# Altium project Intelligent Tidal Energy Monitoring System.PrjPcb
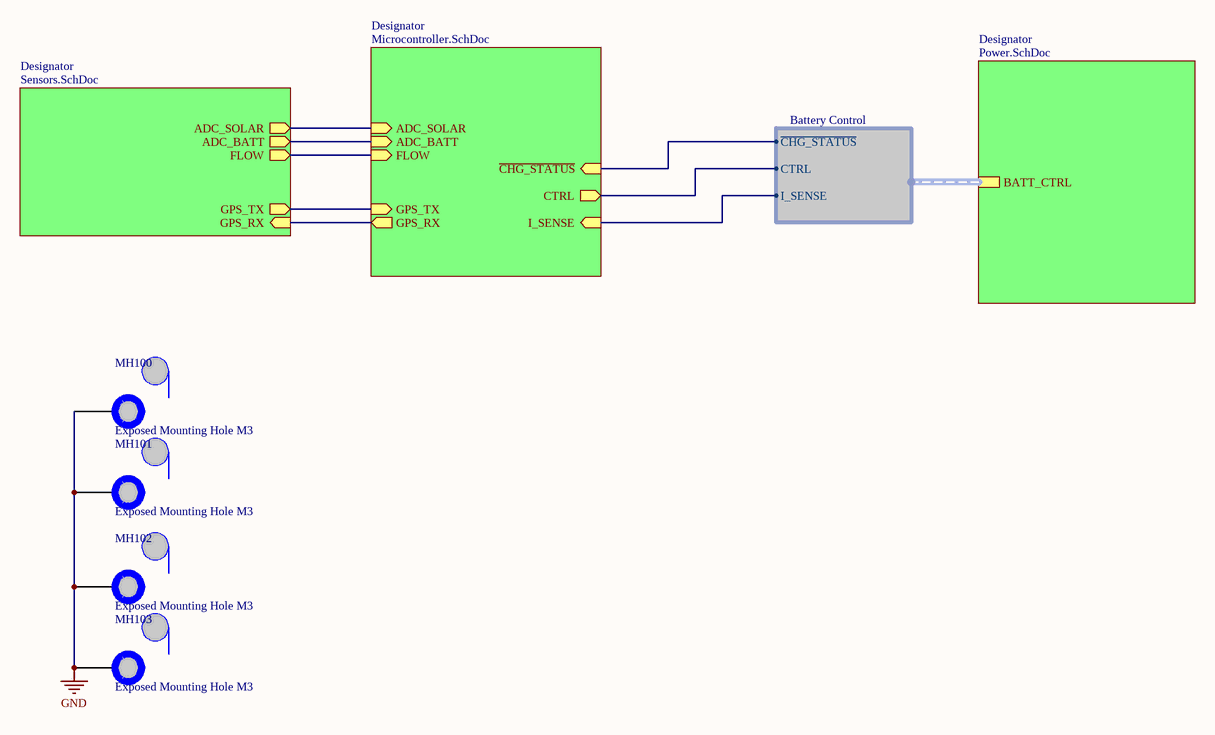
[diagram p0: Master.SchDoc]
5 sheets, 79 parts. Net scope: hierarchical (ports join the sheet entries above them; power ports are global).
Board file: ITEMS PCB Rev A.PcbDoc
Sheets:
  Master.SchDoc
    Designator = Microcontroller.SchDoc
    Designator = Sensors.SchDoc
    Designator = Power.SchDoc
  Block Diagram.SchDoc

## Sheet Master.SchDoc
size A4; SheetNumber: 1; SheetTotal: 5

### Parts
MH100  Exposed Mounting Hole M3  [Mounting Hole M3-Footprint-1]
MH101  Exposed Mounting Hole M3  [Mounting Hole M3-Footprint-1]
MH102  Exposed Mounting Hole M3  [Mounting Hole M3-Footprint-1]
MH103  Exposed Mounting Hole M3  [Mounting Hole M3-Footprint-1]

### Sub-sheets
Designator = Microcontroller.SchDoc: ADC_SOLAR (in), FLOW (in), ADC_BATT (in), GPS_RX (out), GPS_TX (in), CTRL (out), ~{CHG_STATUS} (in), I_SENSE (in)
Designator = Sensors.SchDoc: GPS_TX (out), FLOW (out), ADC_SOLAR (out), GPS_RX (in), ADC_BATT (out)
Designator = Power.SchDoc: BATT_CTRL (harness Battery Control)

### Harnesses
Battery Control: ~{CHG_STATUS}, CTRL, I_SENSE

### Nets
GND: MH100.0 MH101.0 MH102.0 MH103.0
~{CHG}: sheet Designator/~{CHG_STATUS}, sheet Designator/BATT_CTRL.~{CHG_STATUS}
CTRL: sheet Designator/CTRL, sheet Designator/BATT_CTRL.CTRL
I_SENSE: sheet Designator/I_SENSE, sheet Designator/BATT_CTRL.I_SENSE
NetIC400_3: sheet Designator/ADC_BATT, sheet Designator/ADC_BATT
NetIC401_3: sheet Designator/ADC_SOLAR, sheet Designator/ADC_SOLAR
NetJ400_3: sheet Designator/FLOW, sheet Designator/FLOW
NetJ401_2: sheet Designator/GPS_RX, sheet Designator/GPS_RX
NetJ401_3: sheet Designator/GPS_TX, sheet Designator/GPS_TX

### Library data of the parts
MH100-MH103 = CMP-00028-00002-1: M3 Mounting Hole Exposed

## Sheet Microcontroller.SchDoc
size A4; SheetNumber: 2; SheetTotal: 5
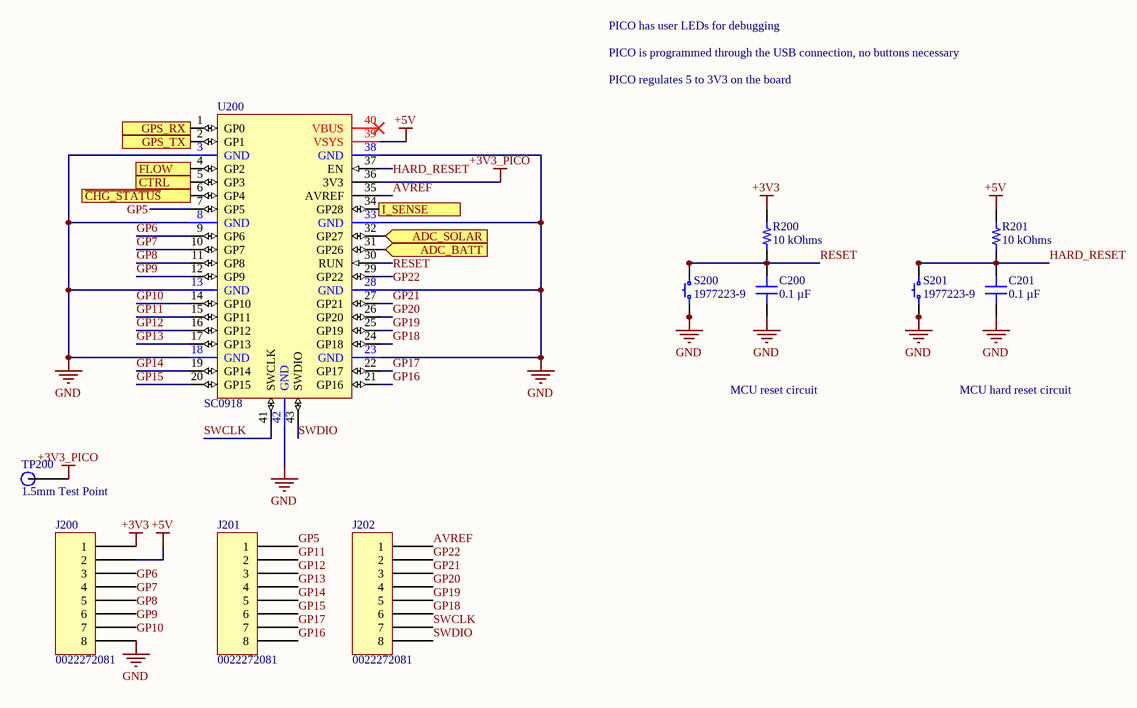
[diagram p1: Microcontroller.SchDoc]

### Parts
C200  0.1 µF  [CAP 0603_1608]
C201  0.1 µF  [CAP 0603_1608]
J200  0022272081  [MOLEX KK 0022272081]
J201  0022272081  [MOLEX KK 0022272081]
J202  0022272081  [MOLEX KK 0022272081]
R200  10 kOhms  [RES 0603_1608]
R201  10 kOhms  [RES 0603_1608]
S200  1977223-9  [TE FSM4JSMA]
S201  1977223-9  [TE FSM4JSMA]
TP200  1.5mm Test Point  [1mm Test Point-Footprint-1]
U200  SC0918  [New footprint 1]

### Ports
ADC_BATT (in), ADC_SOLAR (in), CTRL (out), FLOW (in), GPS_RX (out), GPS_TX (in), I_SENSE (in), ~{CHG_STATUS} (in)

### Nets
+3V3: J200.1 R200.2
+3V3_PICO: TP200.1 U200.36(3V3)
+5V: J200.2 R201.2 U200.39(VSYS)
GND: C200.1 C201.1 J200.8 S200.1 S200.2 S201.1 S201.2 U200.3(GND) U200.8(GND) U200.13(GND) U200.18(GND) U200.23(GND) U200.28(GND) U200.33(GND) U200.38(GND) U200.42(GND)
AVREF: J202.1 U200.35(AVREF)
~{CHG}: U200.6(GP4) ; port ~{CHG_STATUS}
CTRL: U200.5(GP3) ; port CTRL
GP5: J201.1 U200.7(GP5)
GP6: J200.3 U200.9(GP6)
GP7: J200.4 U200.10(GP7)
GP8: J200.5 U200.11(GP8)
GP9: J200.6 U200.12(GP9)
GP10: J200.7 U200.14(GP10)
GP11: J201.2 U200.15(GP11)
GP12: J201.3 U200.16(GP12)
GP13: J201.4 U200.17(GP13)
GP14: J201.5 U200.19(GP14)
GP15: J201.6 U200.20(GP15)
GP16: J201.8 U200.21(GP16)
GP17: J201.7 U200.22(GP17)
GP18: J202.6 U200.24(GP18)
GP19: J202.5 U200.25(GP19)
GP20: J202.4 U200.26(GP20)
GP21: J202.3 U200.27(GP21)
GP22: J202.2 U200.29(GP22)
HARD_RESET: C201.2 R201.1 S201.3 S201.4 U200.37(EN)
I_SENSE: U200.34(GP28) ; port I_SENSE
RESET: C200.2 R200.1 S200.3 S200.4 U200.30(RUN)
SWCLK: J202.7 U200.41(SWCLK)
SWDIO: J202.8 U200.43(SWDIO)
NetIC400_3: U200.31(GP26) ; port ADC_BATT
NetIC401_3: U200.32(GP27) ; port ADC_SOLAR
NetJ400_3: U200.4(GP2) ; port FLOW
NetJ401_2: U200.1(GP0) ; port GPS_RX
NetJ401_3: U200.2(GP1) ; port GPS_TX

Not connected (* = marked no-connect by the designer): U200 40(VBUS)*

### Notes on the sheet
- PICO has user LEDs for debugging
- PICO is programmed through the USB connection, no buttons necessary
- PICO regulates 5 to 3V3 on the board
- MCU reset circuit
- MCU hard reset circuit

### Library data of the parts
C200 C201 = C0603X104M3RAC7867: CAP CER 0.1UF 25V X7R 0603; manufacturer: KEMET; Tolerance: ±20%; Part Number: C0603X104M3RAC7867; Value: 0.1 µF; Applications: Boardflex Sensitive; Capacitance: 0.1 µF; componentlink1description: Datasheet; componentlink1url: https://api.kemet.com/component-edge/download/datasheet/C0603X104M3RACTU.pdf; componentlink2description: DigiKey Link; componentlink2url: https://www.digikey.com/en/products/detail/kemet/C0603X104M3RAC7867/2202613; Device Package: 0603 (1608 Metric); Features: Soft Termination; lastupdated: 2022-03-07 3:18:24 PM; Lifecycle Status: Active; Minimum Order: 1; Mounting Type: Surface Mount, MLCC; Operating Temperature: -55°C ~ 125°C; Package / Case: 0603 (1608 Metric); packaging: TapeAndReel; partid: 2484; Part Status: Active; price: 0.07; series: SMD Comm X7R Flex; Size / Dimension: 0.063" L x 0.031" W (1.60mm x 0.80mm); Supplier 1: DigiKey; Supplier Part Number 1: 399-13148-1-ND; Temperature Coefficient: X7R; Thickness (Max): 0.034" (0.87mm); Voltage - Rated: 25V
J200-J202 = 0022272081: CONN HEADER VERT 8POS 2.54MM; Manufacturer: Molex; Contact Length - Mating: 0.295" (7.49mm); Contact Length - Post: 0.140" (3.56mm); Material Flammability Rating: UL94 V-0; Number of Positions: 8; Number of Positions Loaded: All; Overall Contact Length: 0.560" (14.22mm); Pitch - Mating: 0.100" (2.54mm); Shrouding: Shrouded - 1 Wall; Style: Board to Cable/Wire; Part Number: 0022272081; ComponentLink1Description: Datasheet; ComponentLink1URL: https://www.molex.com/pdm_docs/sd/022272081_sd.pdf; ComponentLink2Description: DigiKey Link; ComponentLink2URL: http://digikey.com/product-detail/en/molex/0022272081/WM4117-ND/1130583; Connector Type: Header; Contact Finish - Mating: Tin; Contact Finish - Post: Tin; Contact Finish Thickness - Mating: 100.0µin (2.54µm); Contact Material: Brass; Contact Shape: Square; Contact Type: Male Pin; Fastening Type: Friction Lock; Insulation Color: Natural; Insulation Height: 0.461" (11.70mm); Insulation Material: Polyamide (PA), Nylon; LastUpdated: 2020-01-12 11:52:41 PM; Lifecycle Status: Active; Minimum Order: 1; Mounting Type: Through Hole; Number of Rows: 1; Packaging: Bulk; PartId: 82; Part Status: Active; Price: 0.60; Series: KK 6410; Supplier 1: DigiKey; Supplier Part Number 1: WM4117-ND; Termination: Solder
R200 R201 = RT0603FRE0710KL: RES SMD 10K OHM 1% 1/10W 0603; Manufacturer: Yageo; Power (Watts): 0.1W, 1/10W; Temperature Coefficient: ±50ppm/°C; Part Number: RT0603FRE0710KL; Value: 10 kOhms; ComponentLink1Description: Datasheet; ComponentLink1URL: https://www.yageo.com/upload/media/product/productsearch/datasheet/rchip/PYu-RT_1-to-0.01_RoHS_L_11.pdf; ComponentLink2Description: DigiKey Link; ComponentLink2URL: http://digikey.com/product-detail/en/yageo/RT0603FRE0710KL/YAG2321CT-ND/5252435; Composition: Thin Film; Device Package: 0603 (1608 Metric); Height - Seated (Max): 0.022" (0.55mm); LastUpdated: 2022-03-07 3:35:56 PM; Lifecycle Status: Active; Minimum Order: 1; Number of Terminations: 2; Operating Temperature: -55°C ~ 155°C; Package / Case: 0603 (1608 Metric); Packaging: TapeAndReel; PartId: 5671; Part Status: Active; Price: 0.01; Resistance: 10 kOhms; Series: RT; Size / Dimension: 0.063" L x 0.031" W (1.60mm x 0.80mm); Supplier 1: DigiKey; Supplier Part Number 1: YAG2321CT-ND; Supplier Device Package: 0603; Tolerance: ±1%
S200 S201 = 1977223-9: SWITCH TACTILE SPST-NO 0.05A 24V; Manufacturer: TE Connectivity ALCOSWITCH Switches; Actuator Height off PCB, Vertical: 5.00mm; Actuator Orientation: Top Actuated; Actuator Type: Standard; Contact Rating @ Voltage: 0.05A @ 24VDC; Illumination: Non-Illuminated; Operating Force: 160gf; Outline: 6.00mm x 6.00mm; Switch Function: Off-Mom; Part Number: 1977223-9; Circuit: SPST-NO; ComponentLink1Description: Datasheet; ComponentLink1URL: https://www.te.com/commerce/DocumentDelivery/DDEController?Action=srchrtrv&DocNm=1308111-1_SWITCHES_CORE_PROGRAM_CATALOG&DocType=CS&DocLang=English; ComponentLink2Description: DigiKey Link; ComponentLink2URL: http://digikey.com/product-detail/en/te-connectivity-alcoswitch-switches/1977223-9/1977223-9-ND/5597033; LastUpdated: 2020-08-30 9:06:45 PM; Lifecycle Status: Active; Minimum Order: 30000; Mounting Type: Surface Mount; Packaging: Bulk; Price: 0.16; Series: FSMJSMA; Supplier 1: DigiKey; Supplier Part Number 1: 1977223-9-ND; Termination Style: Gull Wing
TP200 = CMP-002-00006-1: 1.5mm Test Point 0.75mm hole size
U200 = CMP-00055-1: Raspberry Pi Pico W

## Sheet Sensors.SchDoc
size A4; SheetNumber: 4; SheetTotal: 5
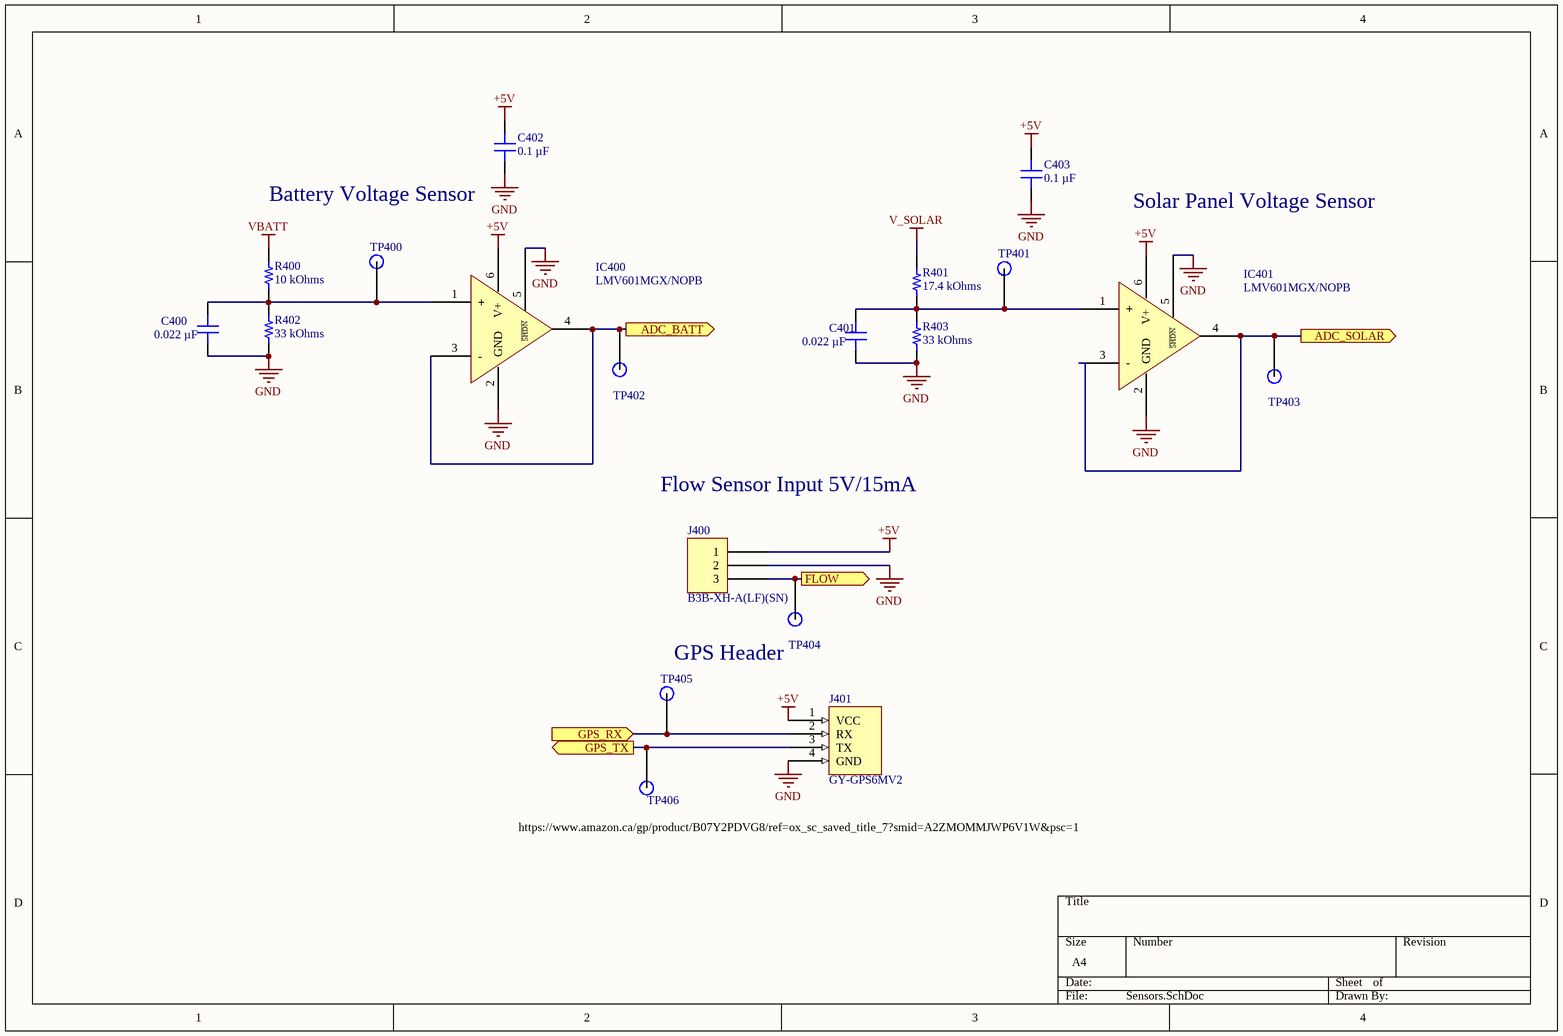
[diagram p2: Sensors.SchDoc]

### Parts
C400  0.022 µF  [CAP 0603_1608]
C401  0.022 µF  [CAP 0603_1608]
C402  0.1 µF  [CAP 0603_1608]
C403  0.1 µF  [CAP 0603_1608]
IC400  LMV601MGX/NOPB  [TI SC70-6 DCK]
IC401  LMV601MGX/NOPB  [TI SC70-6 DCK]
J400  B3B-XH-A(LF)(SN)  [JST XH B3B-XH-A]
J401  GY-GPS6MV2  [GY-GPS6MV2 -Footprint-1]
R400  10 kOhms  [RES 0603_1608]
R401  17.4 kOhms  [RES 0603_1608]
R402  33 kOhms  [RES 0603_1608]
R403  33 kOhms  [RES 0603_1608]
TP400  1.5mm Test Point  [1mm Test Point-Footprint-1]  (value not drawn)
TP401  1.5mm Test Point  [1mm Test Point-Footprint-1]  (value not drawn)
TP402  1.5mm Test Point  [1mm Test Point-Footprint-1]  (value not drawn)
TP403  1.5mm Test Point  [1mm Test Point-Footprint-1]  (value not drawn)
TP404  1.5mm Test Point  [1mm Test Point-Footprint-1]  (value not drawn)
TP405  1.5mm Test Point  [1mm Test Point-Footprint-1]  (value not drawn)
TP406  1.5mm Test Point  [1mm Test Point-Footprint-1]  (value not drawn)

### Ports
ADC_BATT (out), ADC_SOLAR (out), FLOW (out), GPS_RX (in), GPS_TX (out)

### Nets
+5V: C402.2 C403.2 IC400.6(V+) IC401.6(V+) J400.1 J401.1(VCC)
GND: C400.1 C401.1 C402.1 C403.1 IC400.2(GND) IC400.5(~{SHDN}) IC401.2(GND) IC401.5(~{SHDN}) J400.2 J401.4(GND) R402.1 R403.1
V_SOLAR: R401.2
VBATT: R400.2
NetC400_2: C400.2 IC400.1(+) R400.1 R402.2 TP400.1
NetC401_2: C401.2 IC401.1(+) R401.1 R403.2 TP401.1
NetIC400_3: IC400.3(-) IC400.4(OUT) TP402.1 ; port ADC_BATT
NetIC401_3: IC401.3(-) IC401.4(OUT) TP403.1 ; port ADC_SOLAR
NetJ400_3: J400.3 TP404.1 ; port FLOW
NetJ401_2: J401.2(RX) TP405.1 ; port GPS_RX
NetJ401_3: J401.3(TX) TP406.1 ; port GPS_TX

### Notes on the sheet
- (near C402) Battery Voltage Sensor
- Solar Panel Voltage Sensor
- Flow Sensor Input 5V/15mA
- GPS Header
- (near TP406) https://www.amazon.ca/gp/product/B07Y2PDVG8/ref=ox_sc_saved_title_7?smid=A2ZMOMMJWP6V1W&psc=1

### Library data of the parts
C400 C401 = CC0603KRX7R7BB223: CAP CER 0.022UF 16V X7R 0603; manufacturer: Yageo; Tolerance: ±10%; Part Number: CC0603KRX7R7BB223; Value: 0.022 µF; Applications: General Purpose; Capacitance: 0.022 µF; componentlink1description: Datasheet; componentlink1url: https://www.yageo.com/upload/media/product/productsearch/datasheet/mlcc/UPY-GPHC_X7R_6.3V-to-50V_18.pdf; componentlink2description: DigiKey Link; componentlink2url: https://www.digikey.com/en/products/detail/yageo/CC0603KRX7R7BB223/5195208; Device Package: 0603 (1608 Metric); lastupdated: 2022-09-19 1:01:04 PM; Lifecycle Status: Active; Minimum Order: 1; Mounting Type: Surface Mount, MLCC; Operating Temperature: -55°C ~ 125°C; Package / Case: 0603 (1608 Metric); packaging: TapeAndReel; partid: 7845; Part Status: Active; price: 0.01; series: CC; Size / Dimension: 0.063" L x 0.031" W (1.60mm x 0.80mm); Supplier 1: DigiKey; Supplier Part Number 1: 311-1800-1-ND; Temperature Coefficient: X7R; Thickness (Max): 0.035" (0.90mm); Voltage - Rated: 16V
C402 C403 = C0603X104M3RAC7867: as C200 on sheet Microcontroller; Part Number: C0603X104M3RAC7867; Value: 0.1 µF; Applications: Boardflex Sensitive; Capacitance: 0.1 µF; componentlink1description: Datasheet; componentlink1url: https://api.kemet.com/component-edge/download/datasheet/C0603X104M3RACTU.pdf; componentlink2description: DigiKey Link; componentlink2url: https://www.digikey.com/en/products/detail/kemet/C0603X104M3RAC7867/2202613; Device Package: 0603 (1608 Metric); Features: Soft Termination; lastupdated: 2022-03-07 3:18:24 PM; Lifecycle Status: Active; Minimum Order: 1; Mounting Type: Surface Mount, MLCC; Operating Temperature: -55°C ~ 125°C; Package / Case: 0603 (1608 Metric); packaging: TapeAndReel; partid: 2484; Part Status: Active; price: 0.07; series: SMD Comm X7R Flex; Size / Dimension: 0.063" L x 0.031" W (1.60mm x 0.80mm); Supplier 1: DigiKey; Supplier Part Number 1: 399-13148-1-ND; Temperature Coefficient: X7R; Thickness (Max): 0.034" (0.87mm); Voltage - Rated: 25V
IC400 IC401 = LMV601MGX/NOPB: IC OPAMP GP 1 CIRCUIT SC70-6; Manufacturer: Texas Instruments; Amplifier Type: General Purpose; Current - Input Bias: 0.02pA; Current - Output / Channel: 113mA; Current - Supply: 107µA; Gain Bandwidth Product: 1MHz; Number of Circuits: 1; Output Type: Rail-to-Rail; Slew Rate: 1V/µs; Voltage - Input Offset: 250µV; Voltage - Supply, Single/Dual (±): 2.7V ~ 5.5V; Part Number: LMV601MGX/NOPB; ComponentLink1Description: Datasheet; ComponentLink1URL: http://www.ti.com/general/docs/suppproductinfo.tsp?distId=10&gotoUrl=http%3A%2F%2Fwww.ti.com%2Flit%2Fgpn%2Flmv601; ComponentLink2Description: DigiKey Link; ComponentLink2URL: http://digikey.com/product-detail/en/texas-instruments/LMV601MGX-NOPB/296-46438-1-ND/7033611; Device Package: 6-TSSOP, SC-88, SOT-363; LastUpdated: 2020-01-09 2:17:00 AM; Lifecycle Status: Active; Minimum Order: 1; Mounting Type: Surface Mount; Operating Temperature: -40°C ~ 125°C; Package / Case: 6-TSSOP, SC-88, SOT-363; Packaging: ReReel; PartId: 25; Part Status: Active; Price: 0.00; Series: -; Supplier 1: DigiKey; Supplier Part Number 1: 296-46438-1-ND; Supplier Device Package: SC-70-6
J400 = B3B-XH-A(LF)(SN): CONN HEADER VERT 3POS 2.5MM; Manufacturer: JST Sales America Inc.; Contact Length - Post: 0.134" (3.40mm); Current Rating (Amps): 3A; Material Flammability Rating: UL94 V-0; Number of Positions: 3; Number of Positions Loaded: All; Pitch - Mating: 0.098" (2.50mm); Shrouding: Shrouded - 4 Wall; Style: Board to Cable/Wire; Voltage Rating: 250V; Part Number: B3B-XH-A(LF)(SN); ComponentLink1Description: Datasheet; ComponentLink1URL: http://www.jst-mfg.com/product/pdf/eng/eXH.pdf; ComponentLink2Description: DigiKey Link; ComponentLink2URL: http://digikey.com/product-detail/en/jst-sales-america-inc/B3B-XH-A-LF-SN/455-2248-ND/1651046; Connector Type: Header; Contact Finish - Mating: Tin; Contact Finish - Post: Tin; Contact Material: Brass; Contact Shape: Square; Contact Type: Male Pin; Fastening Type: Detent Lock; Insulation Color: Natural; Insulation Height: 0.276" (7.00mm); Insulation Material: Polyamide (PA66), Nylon 6/6; LastUpdated: 2020-01-12 11:46:22 PM; Lifecycle Status: Active; Minimum Order: 1; Mounting Type: Through Hole; Number of Rows: 1; Operating Temperature: -25°C ~ 85°C; Packaging: Bulk; PartId: 68; Part Status: Active; Price: 0.19; Series: XH; Supplier 1: DigiKey; Supplier Part Number 1: 455-2248-ND; Termination: Press-Fit, Solder
J401 = CMP-00056-2: NEO-6M GPS Module
R400 = RT0603FRE0710KL: as R200 on sheet Microcontroller; Part Number: RT0603FRE0710KL; Value: 10 kOhms; ComponentLink1Description: Datasheet; ComponentLink1URL: https://www.yageo.com/upload/media/product/productsearch/datasheet/rchip/PYu-RT_1-to-0.01_RoHS_L_11.pdf; ComponentLink2Description: DigiKey Link; ComponentLink2URL: http://digikey.com/product-detail/en/yageo/RT0603FRE0710KL/YAG2321CT-ND/5252435; Composition: Thin Film; Device Package: 0603 (1608 Metric); Height - Seated (Max): 0.022" (0.55mm); LastUpdated: 2022-03-07 3:35:56 PM; Lifecycle Status: Active; Minimum Order: 1; Number of Terminations: 2; Operating Temperature: -55°C ~ 155°C; Package / Case: 0603 (1608 Metric); Packaging: TapeAndReel; PartId: 5671; Part Status: Active; Price: 0.01; Resistance: 10 kOhms; Series: RT; Size / Dimension: 0.063" L x 0.031" W (1.60mm x 0.80mm); Supplier 1: DigiKey; Supplier Part Number 1: YAG2321CT-ND; Supplier Device Package: 0603; Tolerance: ±1%
R401 = RC0603FR-0717K4L: RES 17.4K OHM 1% 1/10W 0603; Manufacturer: Yageo; Power (Watts): 0.1W, 1/10W; Temperature Coefficient: ±100ppm/°C; Part Number: RC0603FR-0717K4L; Value: 17.4 kOhms; ComponentLink1Description: Datasheet; ComponentLink1URL: https://www.yageo.com/upload/media/product/productsearch/datasheet/rchip/PYu-RC_Group_51_RoHS_L_10.pdf; ComponentLink2Description: DigiKey Link; ComponentLink2URL: https://www.digikey.com/en/products/detail/yageo/RC0603FR-0717K4L/726981; Composition: Thick Film; Device Package: 0603 (1608 Metric); Features: Moisture Resistant; Height - Seated (Max): 0.022" (0.55mm); LastUpdated: 2022-09-19 1:22:24 PM; Lifecycle Status: Active; Minimum Order: 1; Number of Terminations: 2; Operating Temperature: -55°C ~ 155°C; Package / Case: 0603 (1608 Metric); Packaging: CutTape; PartId: 7526; Part Status: Active; Price: 0.01; Resistance: 17.4 kOhms; Series: RC_L; Size / Dimension: 0.063" L x 0.031" W (1.60mm x 0.80mm); Supplier 1: DigiKey; Supplier Part Number 1: 311-17.4KHRCT-ND; Supplier Device Package: 0603; Tolerance: ±1%
R402 R403 = RT0603FRE0733KL: RES SMD 33K OHM 1% 1/10W 0603; Manufacturer: Yageo; Power (Watts): 0.1W, 1/10W; Temperature Coefficient: ±50ppm/°C; Part Number: RT0603FRE0733KL; Value: 33 kOhms; ComponentLink1Description: Datasheet; ComponentLink1URL: https://www.yageo.com/upload/media/product/productsearch/datasheet/rchip/PYu-RT_1-to-0.01_RoHS_L_11.pdf; ComponentLink2Description: DigiKey Link; ComponentLink2URL: https://www.digikey.com/en/products/detail/yageo/RT0603FRE0733KL/1075313; Composition: Thin Film; Device Package: 0603 (1608 Metric); Height - Seated (Max): 0.022" (0.55mm); LastUpdated: 2022-09-19 1:22:31 PM; Lifecycle Status: Active; Minimum Order: 1; Number of Terminations: 2; Operating Temperature: -55°C ~ 155°C; Package / Case: 0603 (1608 Metric); Packaging: TapeAndReel; PartId: 5680; Part Status: Active; Price: 0.01; Resistance: 33 kOhms; Series: RT; Size / Dimension: 0.063" L x 0.031" W (1.60mm x 0.80mm); Supplier 1: DigiKey; Supplier Part Number 1: YAG5959CT-ND; Supplier Device Package: 0603; Tolerance: ±1%
TP400-TP406 = CMP-002-00006-1: 1.5mm Test Point 0.75mm hole size

## Sheet Power.SchDoc
size A4; SheetNumber: 3; SheetTotal: 5
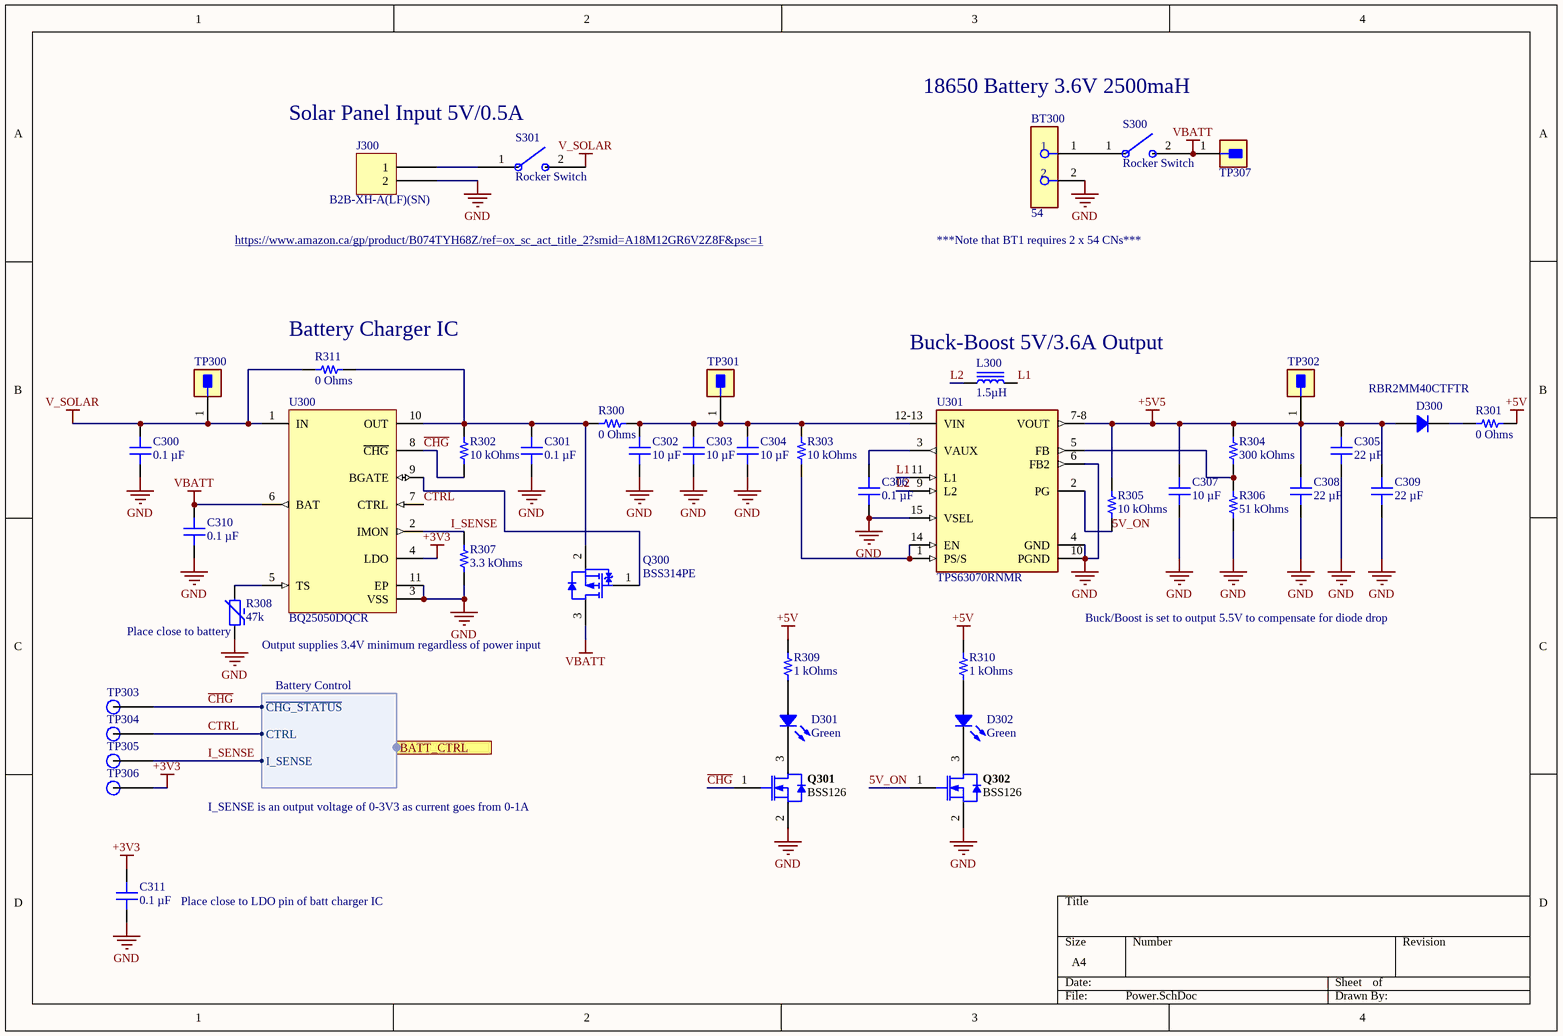
[diagram p3: Power.SchDoc]

### Parts
BT300  54  [FP-54-MFG]
C300  0.1 µF  [CAP 0603_1608]
C301  0.1 µF  [CAP 0603_1608]
C302  10 µF  [CAP 0603_1608]
C303  10 µF  [CAP 0603_1608]
C304  10 µF  [CAP 0603_1608]
C305  22 µF  [CAP 0805_2012]
C306  0.1 µF  [CAP 0603_1608]
C307  10 µF  [CAP 0603_1608]
C308  22 µF  [CAP 0805_2012]
C309  22 µF  [CAP 0805_2012]
C310  0.1 µF  [CAP 0603_1608]
C311  0.1 µF  [CAP 0603_1608]
D300  RBR2MM40CTFTR  [SOD123F]
D301  Green  [LED 0603_1608 GREEN]
D302  Green  [LED 0603_1608 GREEN]
J300  B2B-XH-A(LF)(SN)  [JST XH B2B-XH-A]
L300  1.5µH  [IND 1008_2520]
Q300  BSS314PE  [INF-PG-SOT23_N]
Q301  BSS126  [INF-PG-SOT23_L]
Q302  BSS126  [INF-PG-SOT23_L]
R300  0 Ohms  [RES 0603_1608]
R301  0 Ohms  [RES 0603_1608]
R302  10 kOhms  [RES 0603_1608]
R303  10 kOhms  [RES 0603_1608]
R304  300 kOhms  [RES 0603_1608]
R305  10 kOhms  [RES 0603_1608]
R306  51 kOhms  [RES 0603_1608]
R307  3.3 kOhms  [RES 0603_1608]
R308  47k  [NTC 0603_1608]
R309  1 kOhms  [RES 0603_1608]
R310  1 kOhms  [RES 0603_1608]
R311  0 Ohms  [RES 0603_1608]
S300  Rocker Switch  [Rocker Switch-Footprint-1]
S301  Rocker Switch  [Rocker Switch-Footprint-1]
TP300  S2751-46R  [FP-S2751-46R-MFG]  (value not drawn)
TP301  S2751-46R  [FP-S2751-46R-MFG]  (value not drawn)
TP302  S2751-46R  [FP-S2751-46R-MFG]  (value not drawn)
TP303  1.5mm Test Point  [1mm Test Point-Footprint-1]  (value not drawn)
TP304  1.5mm Test Point  [1mm Test Point-Footprint-1]  (value not drawn)
TP305  1.5mm Test Point  [1mm Test Point-Footprint-1]  (value not drawn)
TP306  1.5mm Test Point  [1mm Test Point-Footprint-1]  (value not drawn)
TP307  S2751-46R  [FP-S2751-46R-MFG]  (value not drawn)
U300  BQ25050DQCR  [DQC0010A]
U301  TPS63070RNMR  [FP-RNM0015A-MFG]

### Ports
BATT_CTRL (out, harness Battery Control)

### Harnesses
Battery Control: ~{CHG_STATUS}, CTRL, I_SENSE

### Nets
+3V3: C311.2 TP306.1 U300.4(LDO)
+5V: R301.2 R309.2 R310.2
+5V5: C305.2 C307.2 C308.2 C309.2 D300.1 R304.2 R305.2 TP302.1 U301.7-8(VOUT)
GND: BT300.2 C300.1 C301.1 C302.1 C303.1 C304.1 C305.1 C306.1 C307.1 C308.1 C309.1 C310.1 C311.1 J300.2 Q301.2(SOURCE) Q302.2(SOURCE) R306.1 R307.1 R308.1 U300.3(VSS) U300.11(EP) U301.4(GND) U301.6(FB2) U301.10(PGND) U301.15(VSEL)
V_SOLAR: C300.2 R311.1 S301.2 TP300.1 U300.1(IN)
VBATT: C310.2 Q300.3(DRAIN) S300.2 TP307.1 U300.6(BAT)
5V_ON: Q302.1(GATE) R305.1 U301.2(PG)
~{CHG}: Q301.1(GATE) R302.1 TP303.1 U300.8(~{CHG}) ; port BATT_CTRL.~{CHG_STATUS}
CTRL: TP304.1 U300.7(CTRL) ; port BATT_CTRL.CTRL
I_SENSE: R307.2 TP305.1 U300.2(IMON) ; port BATT_CTRL.I_SENSE
L1: L300.2 U301.11(L1)
L2: L300.1 U301.9(L2)
NetBT300_1: BT300.1 S300.1
NetC301_2: C301.2 Q300.2(SOURCE) R300.1 R302.2 R311.2 U300.10(OUT)
NetC302_2: C302.2 C303.2 C304.2 R300.2 R303.2 TP301.1 U301.12-13(VIN)
NetC306_2: C306.2 U301.3(VAUX)
NetD300_2: D300.2 R301.1
NetD301_1: D301.1 R309.1
NetD301_2: D301.2 Q301.3(DRAIN)
NetD302_1: D302.1 R310.1
NetD302_2: D302.2 Q302.3(DRAIN)
NetJ300_1: J300.1 S301.1
NetQ300_1: Q300.1(GATE) U300.9(BGATE)
NetR303_1: R303.1 U301.1(PS/S) U301.14(EN)
NetR304_1: R304.1 R306.2 U301.5(FB)
NetR308_2: R308.2 U300.5(TS)

### Notes on the sheet
- 18650 Battery 3.6V 2500maH
- Solar Panel Input 5V/0.5A
- https://www.amazon.ca/gp/product/B074TYH68Z/ref=ox_sc_act_title_2?smid=A18M12GR6V2Z8F&psc=1
- ***Note that BT1 requires 2 x 54 CNs***
- (near R311) Battery Charger IC
- (near L300) Buck-Boost 5V/3.6A Output
- (near R308) Place close to battery
- Output supplies 3.4V minimum regardless of power input
- Buck/Boost is set to output 5.5V to compensate for diode drop
- I_SENSE is an output voltage of 0-3V3 as current goes from 0-1A
- Place close to LDO pin of batt charger IC

### Library data of the parts
BT300 = CMP-00051-1: Cylindrical Battery Contacts, Clips, Holders & Springs 16-19mm PC BATTERY CLIP; Lead Free: Lead Free
C300 C301 C306 C310 C311 = C0603C104K5RAC7411: CAP CER 0.1UF 50V X7R 0603; manufacturer: KEMET; Tolerance: ±10%; Part Number: C0603C104K5RAC7411; Value: 0.1 µF; Applications: Bypass, Decoupling; Capacitance: 0.1 µF; componentlink1description: Datasheet; componentlink1url: https://api.kemet.com/component-edge/download/datasheet/C0603C104K5RAC7411.pdf; componentlink2description: DigiKey Link; componentlink2url: https://www.digikey.com/en/products/detail/kemet/C0603C104K5RAC7411/3317013; Device Package: 0603 (1608 Metric); lastupdated: 2022-09-19 1:01:20 PM; Lifecycle Status: Active; Minimum Order: 15000; Mounting Type: Surface Mount, MLCC; Operating Temperature: -55°C ~ 125°C; Package / Case: 0603 (1608 Metric); packaging: TapeAndReel; partid: 2233; Part Status: Active; price: 0.01; series: SMD Comm X7R; Size / Dimension: 0.063" L x 0.031" W (1.60mm x 0.80mm); Supplier 1: DigiKey; Supplier Part Number 1: 399-7374-2-ND; Temperature Coefficient: X7R; Thickness (Max): 0.035" (0.90mm); Voltage - Rated: 50V
C302-C304 C307 = GRM188R61E106MA73J: CAP CER 10UF 25V X5R 0603; manufacturer: Murata Electronics; Tolerance: ±20%; Part Number: GRM188R61E106MA73J; Value: 10 µF; Applications: General Purpose; Capacitance: 10 µF; componentlink1description: Datasheet; componentlink1url: https://search.murata.co.jp/Ceramy/image/img/A01X/G101/ENG/GRM188R61E106MA73-01.pdf; componentlink2description: DigiKey Link; componentlink2url: https://www.digikey.com/en/products/detail/murata-electronics/GRM188R61E106MA73J/4905347; Device Package: 0603 (1608 Metric); lastupdated: 2022-09-19 1:00:57 PM; Lifecycle Status: Active; Minimum Order: 1; Mounting Type: Surface Mount, MLCC; Operating Temperature: -55°C ~ 85°C; Package / Case: 0603 (1608 Metric); packaging: TapeAndReel; partid: 10710; Part Status: Active; price: 0.05; series: GRM; Size / Dimension: 0.063" L x 0.031" W (1.60mm x 0.80mm); Supplier 1: DigiKey; Supplier Part Number 1: 490-12737-1-ND; Temperature Coefficient: X5R; Thickness (Max): 0.039" (1.00mm); Voltage - Rated: 25V
C305 C308 C309 = CL21A226MOQNNNE: CAP CER 22UF 16V X5R 0805; manufacturer: Samsung Electro-Mechanics; Tolerance: ±20%; Part Number: CL21A226MOQNNNE; Value: 22 µF; Applications: General Purpose; Capacitance: 22 µF; componentlink1description: Datasheet; componentlink1url: http://www.samsungsem.com/kr/support/product-search/mlcc/CL21A226MOQNNNE.jsp; componentlink2description: DigiKey Link; componentlink2url: https://www.digikey.com/en/products/detail/samsung-electro-mechanics/CL21A226MOQNNNE/3888567; Device Package: 0805 (2012 Metric); lastupdated: 2022-09-19 1:04:25 PM; Lifecycle Status: Active; Minimum Order: 1; Mounting Type: Surface Mount, MLCC; Operating Temperature: -55°C ~ 85°C; Package / Case: 0805 (2012 Metric); packaging: TapeAndReel; partid: 3052; Part Status: Active; price: 0.05; series: CL; Size / Dimension: 0.079" L x 0.049" W (2.00mm x 1.25mm); Supplier 1: DigiKey; Supplier Part Number 1: 1276-2909-1-ND; Temperature Coefficient: X5R; Thickness (Max): 0.055" (1.40mm); Voltage - Rated: 16V
D300 = RBR2MM40CTFTR: DIODE (RECTIFIER FRD) 40V-VR 2A-; Manufacturer: Rohm Semiconductor; Current - Average Rectified (Io): 2A; Current - Reverse Leakage @ Vr: 100 µA @ 40 V; Diode Type: Schottky; Speed: Fast Recovery =< 500ns, > 200mA (Io); Voltage - DC Reverse (Vr) (Max): 40 V; Voltage - Forward (Vf) (Max) @ If: 520 mV @ 2 A; Part Number: RBR2MM40CTFTR; ComponentLink1Description: Datasheet; ComponentLink1URL: https://www.rohm.com/datasheet/RBR2MM40CTF/rbr2mm40ctftr-e; ComponentLink2Description: DigiKey Link; ComponentLink2URL: https://www.digikey.com/en/products/detail/rohm-semiconductor/RBR2MM40CTFTR/9748140; LastUpdated: 2022-09-19 1:46:35 PM; Lifecycle Status: Active; Minimum Order: 1; Mounting Type: Surface Mount; Operating Temperature - Junction: 150°C (Max); Package / Case: SOD-123F; Packaging: TapeAndReel; PartId: 2367; Part Status: Active; Price: 0.12; Series: Automotive, AEC-Q101; Supplier 1: DigiKey; Supplier Part Number 1: RBR2MM40CTFCT-ND; Supplier Device Package: PMDU
D301 D302 = XZVGT53W-6: LED GREEN CLEAR 2SMD; Manufacturer: SunLED; Configuration: Standard; Current - Test: 20mA; Lens Color: Colorless; Lens Size: 1.20mm x 0.80mm; Lens Style: Rectangle with Flat Top; Millicandela Rating: 49mcd; Viewing Angle: 120°; Voltage - Forward (Vf) (Typ): 2.1V; Wavelength - Dominant: 570nm; Wavelength - Peak: 574nm; Part Number: XZVGT53W-6; Color: Green; ComponentLink1Description: Datasheet; ComponentLink1URL: https://www.sunledusa.com/products/spec/XZVGT53W-6.pdf; ComponentLink2Description: DigiKey Link; ComponentLink2URL: https://www.digikey.com/en/products/detail/sunled/XZVGT53W-6/4902128; Device Package: 0603 (1608 Metric); Height (Max): 0.28mm; LastUpdated: 2022-09-13 7:29:38 AM; Lens Transparency: Clear; Lifecycle Status: Active; Minimum Order: 1; Mounting Type: Surface Mount; Package / Case: 0603 (1608 Metric); Packaging: TapeAndReel; PartId: 581; Part Status: Active; Price: 0.05; Series: -; Size / Dimension: 1.60mm L x 0.80mm W; Supplier 1: DigiKey; Supplier Part Number 1: 1497-1243-1-ND; Supplier Device Package: 2-SMD; Value: Green
J300 = B2B-XH-A(LF)(SN): CONN HEADER VERT 2POS 2.5MM; Manufacturer: JST Sales America Inc.; Contact Length - Post: 0.134" (3.40mm); Current Rating (Amps): 3A; Material Flammability Rating: UL94 V-0; Number of Positions: 2; Number of Positions Loaded: All; Pitch - Mating: 0.098" (2.50mm); Shrouding: Shrouded - 4 Wall; Style: Board to Cable/Wire; Voltage Rating: 250V; Part Number: B2B-XH-A(LF)(SN); ComponentLink1Description: Datasheet; ComponentLink1URL: http://www.jst-mfg.com/product/pdf/eng/eXH.pdf; ComponentLink2Description: DigiKey Link; ComponentLink2URL: http://digikey.com/product-detail/en/jst-sales-america-inc/B2B-XH-A-LF-SN/455-2247-ND/1651045; Connector Type: Header; Contact Finish - Mating: Tin; Contact Finish - Post: Tin; Contact Material: Brass; Contact Shape: Square; Contact Type: Male Pin; Fastening Type: Detent Lock; Insulation Color: Natural; Insulation Height: 0.276" (7.00mm); Insulation Material: Polyamide (PA66), Nylon 6/6; LastUpdated: 2020-01-12 11:46:08 PM; Lifecycle Status: Active; Minimum Order: 1; Mounting Type: Through Hole; Number of Rows: 1; Operating Temperature: -25°C ~ 85°C; Packaging: Bulk; PartId: 67; Part Status: Active; Price: 0.15; Series: XH; Supplier 1: DigiKey; Supplier Part Number 1: 455-2247-ND; Termination: Press-Fit, Solder
L300 = CVH252009-1R5M: FIXED IND 1.5UH 1.5A 70 MOHM SMD; Manufacturer: Bourns Inc.; DC Resistance (DCR): 70mOhm Max; Frequency - Self Resonant: 50MHz; Inductance Frequency - Test: 1MHz; Material - Core: Ferrite; Shielding: Shielded; Tolerance: ±20%; Type: Multilayer; Part Number: CVH252009-1R5M; ComponentLink1Description: Datasheet; ComponentLink1URL: https://www.bourns.com/docs/Product-Datasheets/CVH.pdf; ComponentLink2Description: DigiKey Link; ComponentLink2URL: http://digikey.com/product-detail/en/bourns-inc/CVH252009-1R5M/CVH252009-1R5MCT-ND/3440084; Current Rating (Amps): 1.5A; Device Package: 1008 (2520 Metric); Height - Seated (Max): 0.039" (1.00mm); Inductance: 1.5µH; LastUpdated: 2020-09-02 1:28:58 AM; Lifecycle Status: Active; Minimum Order: 1; Mounting Type: Surface Mount; Operating Temperature: -55°C ~ 125°C; Package / Case: 1008 (2520 Metric); Packaging: TapeAndReel; PartId: 3416; Part Status: Active; Price: 0.10; Series: CVH252009; Size / Dimension: 0.098" L x 0.079" W (2.50mm x 2.00mm); Supplier 1: DigiKey; Supplier Part Number 1: CVH252009-1R5MCT-ND; Supplier Device Package: 1008 (2520 Metric); Value: 1.5µH
Q300 = CMP-1099-00027-1: P-Channel OptiMOS P3 Small-Signal-Transistor, -30 V VDS, -1.5 A ID, -55 to 150 degC, PG-SOT23, Reel, Green; Manufacturer: Infineon; Rth: 250Â K/W; RDS (on) (max): 140Â mOhm; QG: -2.9Â nC; IDpuls (max): -6.1Â A; RDS (on) (max) (@4.5V): 230Â mOhm; Pto t (max): 0.5Â W; Green: TRUE; VDS (max): -30Â V; VGS(th) (max): -2Â V; VGS(th) (min): -1Â V; ID (max): -1.5Â A; ComponentLink2URL: http://www.infineon.com/dgdl/BSS314PE_rev2.3.pdf?folderId=db3a304314dca38901154a72e3951a65&fileId=db3a304330f68606013109b696aa0084; ComponentLink3Description: Package Specification; ComponentLink1URL: http://www.infineon.com/; ComponentLink1Description: Manufacturer URL; Mounting Technology: Surface Mount; PartNumber: BSS314PE; PackageReference: PG-SOT23; PackageVersion: Apr-08; Halogen-free: TRUE; ComponentLink3URL: http://www.infineon.com/dgdl/SOT23-Package_Overview.pdf?folderId=db3a30431936bc4b0119532290053c66&fileId=db3a30431936bc4b0119533468123c85; PackageDescription: 3-Pin Small Outline Transistor Package, 2.9 x 1.3 mm Body, 0.95 mm Pitch; ComponentLink2Description: Datasheet; DatasheetVersion: Rev. 2.3; Packing: Reel
Q301 Q302 = CMP-1153-00007-1: N-Channel SIPMOS Small-Signal-Transistor, 600 V VDS, 0.021 A ID, -55 to 150 degC, PG-SOT23, Reel, Green; Manufacturer: Infineon; VGS(th)(min): -2.7Â V; RDS (on)(max): 700 mOhm; VGS(th)(max): -1.6Â V; Green: TRUE; RthJC(max): 350 K/W; IDpuls(max): 0.085Â A; Ptot(max): 0.5 W; QG: 1.4Â nC; VDS (max): 600 V; ID(max): 0.021Â A; Mode: Depletion; PackageDescription: 3-Pin Small Outline Transistor Package, 2.9 x 1.3 mm Body, 0.95 mm Pitch; ComponentLink3URL: http://www.infineon.com/dgdl/SOT23-Package_Overview.pdf?folderId=db3a30431936bc4b0119532290053c66&fileId=db3a30431936bc4b0119533468123c85; PackageReference: PG-SOT23; PackageVersion: Apr-08; Halogen-free: TRUE; DatasheetVersion: Rev. 2.1; ComponentLink1Description: Manufacturer URL; ComponentLink2URL: http://www.infineon.com/dgdl/BSS126_Rev2.1.pdf?folderId=db3a3043156fd573011622e10b5c1f67&fileId=db3a304330f6860601310483af163eba; Packing: Reel; ComponentLink3Description: Package Specification; ComponentLink2Description: Datasheet; ComponentLink1URL: http://www.infineon.com/; PartNumber: BSS126; Mounting Technology: Surface Mount; Technology: SIPMOS
R300 R301 R311 = PA0603-R-070RL: RES 0 OHM JUMPER 1/10W 0603; Manufacturer: Yageo; Power (Watts): 0.1W, 1/10W; Temperature Coefficient: ±150ppm/°C; Part Number: PA0603-R-070RL; Value: 0 Ohms; ComponentLink1Description: Datasheet; ComponentLink1URL: http://www.yageo.com/NewPortal/_en/search/productDocs.jsp?YageoPartNumber=PA0603-R-070RL; ComponentLink2Description: DigiKey Link; ComponentLink2URL: https://www.digikey.com/en/products/detail/yageo/PA0603-R-070RL/8255972; Composition: Metal Element; Device Package: 0603 (1608 Metric); Features: Automotive AEC-Q200, Current Sense; Height - Seated (Max): 0.024" (0.60mm); LastUpdated: 2022-09-19 1:22:34 PM; Lifecycle Status: Active; Minimum Order: 1; Number of Terminations: 2; Operating Temperature: -55°C ~ 155°C; Package / Case: 0603 (1608 Metric); Packaging: TapeAndReel; PartId: 4862; Part Status: Active; Price: 0.08; Resistance: 0 Ohms; Series: PA; Size / Dimension: 0.063" L x 0.031" W (1.60mm x 0.80mm); Supplier 1: DigiKey; Supplier Part Number 1: YAG5757CT-ND; Supplier Device Package: 0603; Tolerance: Jumper
R302 R303 R305 = RT0603FRE0710KL: as R200 on sheet Microcontroller; Part Number: RT0603FRE0710KL; Value: 10 kOhms; ComponentLink1Description: Datasheet; ComponentLink1URL: https://www.yageo.com/upload/media/product/productsearch/datasheet/rchip/PYu-RT_1-to-0.01_RoHS_L_11.pdf; ComponentLink2Description: DigiKey Link; ComponentLink2URL: https://www.digikey.com/en/products/detail/yageo/RT0603FRE0710KL/1075040; Composition: Thin Film; Device Package: 0603 (1608 Metric); Height - Seated (Max): 0.022" (0.55mm); LastUpdated: 2022-09-19 1:22:31 PM; Lifecycle Status: Active; Minimum Order: 1; Number of Terminations: 2; Operating Temperature: -55°C ~ 155°C; Package / Case: 0603 (1608 Metric); Packaging: TapeAndReel; PartId: 5671; Part Status: Active; Price: 0.01; Resistance: 10 kOhms; Series: RT; Size / Dimension: 0.063" L x 0.031" W (1.60mm x 0.80mm); Supplier 1: DigiKey; Supplier Part Number 1: YAG2321CT-ND; Supplier Device Package: 0603; Tolerance: ±1%
R304 = RC0603FR-07300KL: RES 300K OHM 1% 1/10W 0603; Manufacturer: Yageo; Power (Watts): 0.1W, 1/10W; Temperature Coefficient: ±100ppm/°C; Part Number: RC0603FR-07300KL; Value: 300 kOhms; ComponentLink1Description: Datasheet; ComponentLink1URL: https://www.yageo.com/upload/media/product/productsearch/datasheet/rchip/PYu-RC_Group_51_RoHS_L_10.pdf; ComponentLink2Description: DigiKey Link; ComponentLink2URL: https://www.digikey.com/en/products/detail/yageo/RC0603FR-07300KL/727145; Composition: Thick Film; Device Package: 0603 (1608 Metric); Features: Moisture Resistant; Height - Seated (Max): 0.022" (0.55mm); LastUpdated: 2022-09-19 1:22:24 PM; Lifecycle Status: Active; Minimum Order: 1; Number of Terminations: 2; Operating Temperature: -55°C ~ 155°C; Package / Case: 0603 (1608 Metric); Packaging: CutTape; PartId: 7517; Part Status: Active; Price: 0.01; Resistance: 300 kOhms; Series: RC_L; Size / Dimension: 0.063" L x 0.031" W (1.60mm x 0.80mm); Supplier 1: DigiKey; Supplier Part Number 1: 311-300KHRCT-ND; Supplier Device Package: 0603; Tolerance: ±1%
R306 = CRCW060351K0FKEA: RES SMD 51K OHM 1% 1/10W 0603; Manufacturer: Vishay Dale; Power (Watts): 0.1W, 1/10W; Temperature Coefficient: ±100ppm/°C; Part Number: CRCW060351K0FKEA; Value: 51 kOhms; ComponentLink1Description: Datasheet; ComponentLink1URL: http://www.vishay.com/docs/20035/dcrcwe3.pdf; ComponentLink2Description: DigiKey Link; ComponentLink2URL: http://digikey.com/product-detail/en/vishay-dale/CRCW060351K0FKEA/541-51.0KHCT-ND/1180004; Composition: Thick Film; Device Package: 0603 (1608 Metric); Features: Automotive AEC-Q200; Height - Seated (Max): 0.020" (0.50mm); LastUpdated: 2022-09-19 1:22:23 PM; Lifecycle Status: Active; Minimum Order: 1; Number of Terminations: 2; Operating Temperature: -55°C ~ 155°C; Package / Case: 0603 (1608 Metric); Packaging: CutTape; PartId: 7831; Part Status: Active; Price: 0.10; Ratings: AEC-Q200; Resistance: 51 kOhms; Series: CRCW; Size / Dimension: 0.061" L x 0.033" W (1.55mm x 0.85mm); Supplier 1: DigiKey; Supplier Part Number 1: 541-51.0KHCT-ND; Supplier Device Package: 0603; Tolerance: ±1%
R307 = CRGP0603F3K3: RES 3.3K OHM 1% 1/4W 0603; Manufacturer: TE Connectivity Passive Product; Power (Watts): 0.25W, 1/4W; Temperature Coefficient: ±100ppm/°C; Part Number: CRGP0603F3K3; Value: 3.3 kOhms; ComponentLink1Description: Datasheet; ComponentLink1URL: https://www.te.com/commerce/DocumentDelivery/DDEController?Action=srchrtrv&DocNm=9-1773463-9&DocType=DS&DocLang=English; ComponentLink2Description: DigiKey Link; ComponentLink2URL: https://www.digikey.com/en/products/detail/te-connectivity-passive-product/CRGP0603F3K3/8577024; Composition: Thick Film; Device Package: 0603 (1608 Metric); Features: Pulse Withstanding; Height - Seated (Max): 0.022" (0.55mm); LastUpdated: 2022-09-19 1:22:34 PM; Lifecycle Status: Active; Minimum Order: 1; Number of Terminations: 2; Operating Temperature: -55°C ~ 155°C; Package / Case: 0603 (1608 Metric); Packaging: TapeAndReel; PartId: 5037; Part Status: Active; Price: 0.02; Resistance: 3.3 kOhms; Series: CRGP; Size / Dimension: 0.063" L x 0.031" W (1.60mm x 0.80mm); Supplier 1: DigiKey; Supplier Part Number 1: A130422CT-ND; Supplier Device Package: 0603; Tolerance: ±1%
R308 = NCP18WB473F10RB: THERMISTOR NTC 47KOHM 4050K 0603; Manufacturer: Murata Electronics; B25/100: 4131K; B25/85: 4108K; B Value Tolerance: ±1.5%; Power - Max: 100mW; Resistance Tolerance: ±1%; Part Number: NCP18WB473F10RB; B25/50: 4050K; ComponentLink1Description: Datasheet; ComponentLink1URL: https://www.murata.com/~/media/webrenewal/support/library/catalog/products/thermistor/ntc/r44e.ashx?la=en-us; ComponentLink2Description: DigiKey Link; ComponentLink2URL: http://digikey.com/product-detail/en/murata-electronics/NCP18WB473F10RB/490-6942-2-ND/2595099; Device Package: 0603 (1608 Metric); LastUpdated: 2022-09-19 1:53:39 PM; Lifecycle Status: Active; Minimum Order: 0; Mounting Type: Surface Mount; Operating Temperature: -40°C ~ 125°C; Package / Case: 0603 (1608 Metric); Packaging: TapeAndReel; PartId: 378; Part Status: Active; Price: 0.20; Resistance in Ohms @ 25°C: 47k; Series: NCP18; Supplier 1: DigiKey; Supplier Part Number 1: 490-6942-2-ND; Value: 47k
R309 R310 = RT0603FRE071KL: RES SMD 1K OHM 1% 1/10W 0603; Manufacturer: Yageo; Power (Watts): 0.1W, 1/10W; Temperature Coefficient: ±50ppm/°C; Part Number: RT0603FRE071KL; Value: 1 kOhms; ComponentLink1Description: Datasheet; ComponentLink1URL: https://www.yageo.com/upload/media/product/productsearch/datasheet/rchip/PYu-RT_1-to-0.01_RoHS_L_11.pdf; ComponentLink2Description: DigiKey Link; ComponentLink2URL: https://www.digikey.com/en/products/detail/yageo/RT0603FRE071KL/1075188; Composition: Thin Film; Device Package: 0603 (1608 Metric); Height - Seated (Max): 0.022" (0.55mm); LastUpdated: 2022-09-14 8:09:45 AM; Lifecycle Status: Active; Minimum Order: 1; Number of Terminations: 2; Operating Temperature: -55°C ~ 155°C; Package / Case: 0603 (1608 Metric); Packaging: TapeAndReel; PartId: 5672; Part Status: Active; Price: 0.01; Resistance: 1 kOhms; Series: RT; Size / Dimension: 0.063" L x 0.031" W (1.60mm x 0.80mm); Supplier 1: DigiKey; Supplier Part Number 1: YAG2323CT-ND; Supplier Device Package: 0603; Tolerance: ±1%
S300 S301 = CMP-00054-3: 12mm x 18.5mm Rocker Switch 6A 250VAC
TP300-TP302 TP307 = CMP-00053-4: Conn Test Point 1 POS Solder ST SMD 1 Port T/R; Body Material: Brass; Plating: Tin; Packaging: Cut Tape; Series: S2751, EZ BoardWare; Material: Copper Alloy; Color: Natural; Mount: Surface Mount
TP303-TP306 = CMP-002-00006-1: 1.5mm Test Point 0.75mm hole size
U300 = CMP-0321-00476-2: 1 A, Single-Input, Single Cell Li-Ion Battery Charger with 50 mA LDO, -40 to 85 degC, 10-pin WSON (DQC), Green (RoHS & no Sb/Br); Manufacturer: Texas Instruments; Li-Polymer: N; SubFamily: Battery Charge Management; PartNumber: BQ25050DQCR; ComponentLink1URL: http://www.ti.com/general/docs/lit/getliterature.tsp?genericPartNumber=BQ25050&fileType=pdf; DatasheetVersion: SLUSA33; Li-Ion: N; NiCd: N; Lead Acid: N; NiMH: N; Eco-Plan: Green (RoHS & no Sb/Br); ComponentLink1Description: Datasheet; Over Voltage Protection: N; Mounting Technology: Surface Mount; PackageDescription: 10-Pin Plastic Small Outline No-Lead, 2 x 3 x 0.8 mm Body, 0.5 mm Pitch, Exposed Pad; PackageReference: DQC0010A; PackageVersion: revA, Jul-2008
U301 = CMP-04918-000409-1: IC REG BCK BST ADJ 3.6A 15VQFN; Synchronous Rectifier: Yes; Output Type: Adjustable; Output Current: 2A; Max Input Voltage: 16V; Switching Frequency: 2.4MHz; Min Output Voltage: 2.5V; Output Configuration: Positive; Min Input Voltage: 2V; Topology: Buck-Boost; Number of Outputs: 1; Max Output Voltage: 9V; Quiescent Current: 50uA; Max Operating Temperature: 125°C; Case/Package: VQFN; Number of Pins: 15; RoHS Compliant: Yes; Mount: Surface Mount; Min Operating Temperature: -40°C; Lead Free: Lead Free; Packaging: Tape and Reel

## Sheet Block Diagram.SchDoc
size 420 x 297 mm; SheetNumber: 6; SheetTotal: 6
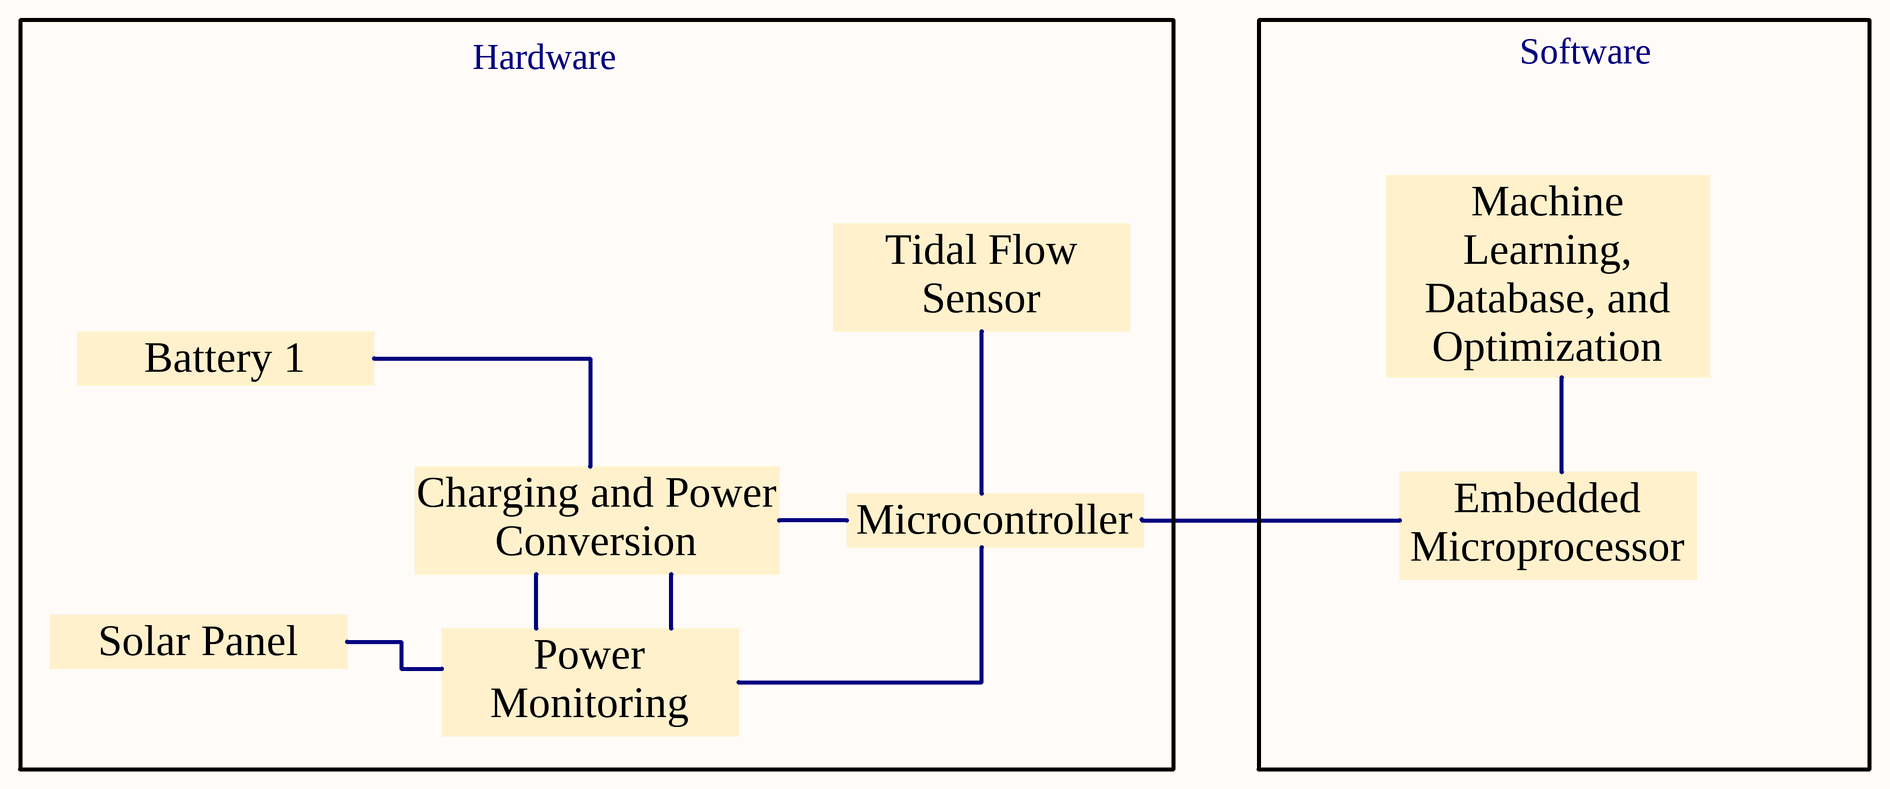
[diagram p4: Block Diagram.SchDoc]

### Notes on the sheet
- Hardware
- Software
- Tidal Flow Sensor
- Battery 1
- Machine Learning, Database, and Optimization
- Microcontroller
- Charging and Power Conversion
- Embedded Microprocessor
- Solar Panel
- Power Monitoring
- THIS DOCUMENT AND THE DATA DISCLOSED HEREIN OR
- HEREWITH IS THE PROPERTY OF ALTIUM LIMITED AND MAY
- DWG NO:
- REVISION
- REV:
- DESCRIPTION
- DATE
- APPROVED
- BE FREELY DISTRIBUTED IN WHOLE. NO RIGHTS ARE
- RESERVED OR EXPRESS OR IMPLIED WARANTEE GIVEN.
- ENG:
- APPROVALS
- PROJECT
- DSN:
- CHK:
- REFERENCE DOCUMENTS
- PROJECT REVISION:
- TITLE
- DOCUMENT REVISION:
- DESIGN ITEM:
- BOM:
- FAB DWG:
- PCB DWG:
- ASSY DWG:
- SCALE:
- A3
- SIZE
- CAGE CODE
- FILE NAME
- DWG NO.
- SHEET
- OF
- REV

## Nets that join several sheets
+3V3: Microcontroller (J200.1 R200.2), Power (C311.2 TP306.1 U300.4)
+5V: Microcontroller (J200.2 R201.2 U200.39), Sensors (6 pins), Power (R301.2 R309.2 R310.2)
GND: Master (MH100.0 MH101.0 MH102.0 MH103.0), Microcontroller (16 pins), Sensors (12 pins), Power (25 pins)
V_SOLAR: Sensors (R401.2), Power (5 pins)
VBATT: Sensors (R400.2), Power (5 pins)
~{CHG}: Microcontroller (U200.6), Power (Q301.1 R302.1 TP303.1 U300.8)
CTRL: Microcontroller (U200.5), Power (TP304.1 U300.7)
I_SENSE: Microcontroller (U200.34), Power (R307.2 TP305.1 U300.2)
NetIC400_3: Microcontroller (U200.31), Sensors (IC400.3 IC400.4 TP402.1)
NetIC401_3: Microcontroller (U200.32), Sensors (IC401.3 IC401.4 TP403.1)
NetJ400_3: Microcontroller (U200.4), Sensors (J400.3 TP404.1)
NetJ401_2: Microcontroller (U200.1), Sensors (J401.2 TP405.1)
NetJ401_3: Microcontroller (U200.2), Sensors (J401.3 TP406.1)

## Assembly variants
ITEMS PCBA Rev A: not fitted J200 J201 J202 R?